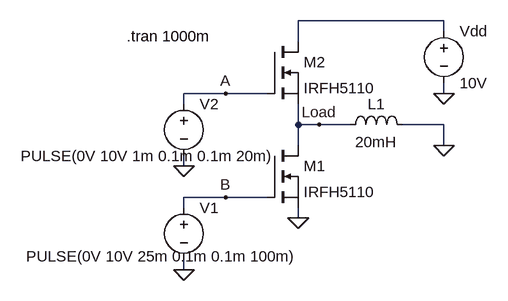
[diagram p0: schematic MOS-switch-ind-body-sync.asc]
MOS-switch-ind-body-sync.asc, the LTspice schematic file:
Version 4
SHEET 1 880 680
WIRE 480 16 256 16
WIRE 480 32 480 16
WIRE 256 48 256 16
WIRE 144 128 80 128
WIRE 208 128 144 128
WIRE 480 128 480 112
WIRE 80 144 80 128
WIRE 256 176 256 144
WIRE 288 176 256 176
WIRE 336 176 288 176
WIRE 480 176 416 176
WIRE 256 208 256 176
WIRE 480 208 480 176
WIRE 80 240 80 224
WIRE 144 288 80 288
WIRE 208 288 144 288
WIRE 80 304 80 288
WIRE 256 320 256 304
WIRE 80 400 80 384
FLAG 480 128 0
FLAG 256 320 0
FLAG 80 400 0
FLAG 480 208 0
FLAG 80 240 0
FLAG 288 176 Load
FLAG 144 128 A
FLAG 144 288 B
SYMBOL voltage 480 16 R0
WINDOW 123 0 0 Left 0
WINDOW 39 0 0 Left 0
SYMATTR InstName Vdd
SYMATTR Value 10V
SYMBOL nmos 208 208 R0
SYMATTR InstName M1
SYMATTR Value IRFH5110
SYMBOL ind 320 192 R270
WINDOW 0 32 56 VTop 2
WINDOW 3 5 56 VBottom 2
SYMATTR InstName L1
SYMATTR Value 20mH
SYMBOL voltage 80 288 R0
WINDOW 3 -243 91 Left 2
WINDOW 123 0 0 Left 0
WINDOW 39 -9 169 Left 2
SYMATTR Value PULSE(0V 10V 25m 0.1m 0.1m 100m)
SYMATTR InstName V1
SYMBOL nmos 208 48 R0
SYMATTR InstName M2
SYMATTR Value IRFH5110
SYMBOL voltage 80 128 R0
WINDOW 3 -251 96 Left 2
WINDOW 123 0 0 Left 0
WINDOW 39 -9 169 Left 2
SYMATTR Value PULSE(0V 10V 1m 0.1m 0.1m 20m)
SYMATTR InstName V2
TEXT -8 40 Left 2 !.tran 1000m

The netlist it stands for:
* MOS-switch-ind-body-sync.asc
Vdd N001 0 10V
M1 Load B 0 0 IRFH5110
L1 Load 0 20mH
V1 B 0 PULSE(0V 10V 25m 0.1m 0.1m 100m)
M2 N001 A Load Load IRFH5110
V2 A 0 PULSE(0V 10V 1m 0.1m 0.1m 20m)
.model NMOS NMOS
.model PMOS PMOS
.lib standard.mos
.tran 1000m
.backanno
.end